# Altium schematic sheet Sheet1.SchDoc
size 431 x 279 mm; SheetNumber: 1; SheetTotal: 1; ENG_APP_DATE: --/--/--; DSN_APP_DATE: --/--/--; CHK_APP_DATE: --/--/--
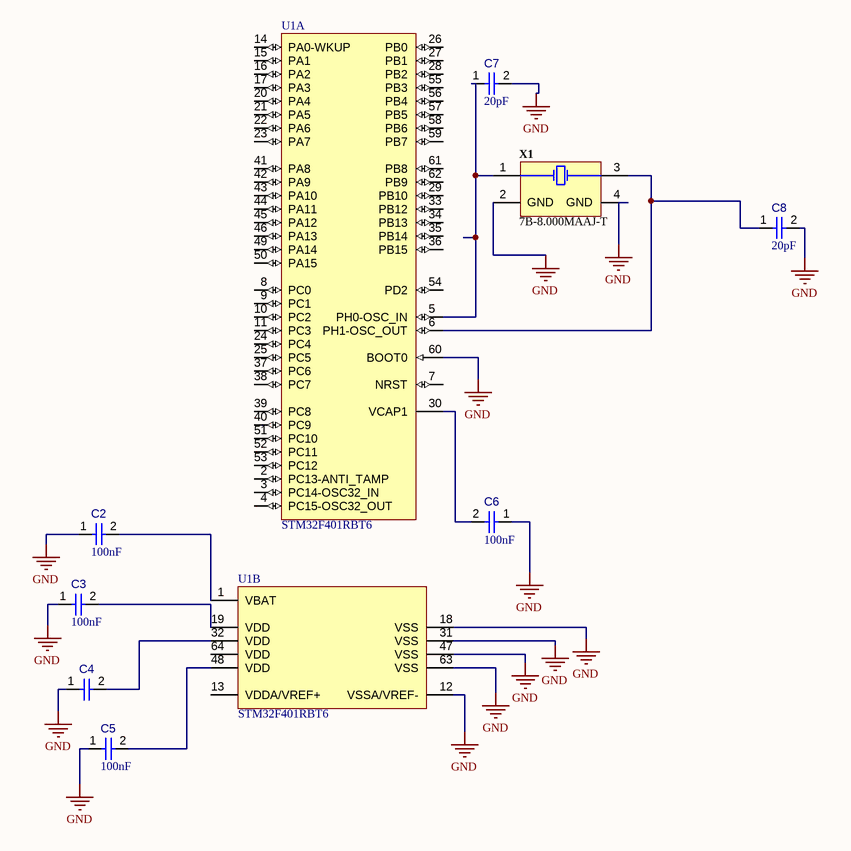
[diagram p0: Sheet1.SchDoc]

## Parts
C2  value 100nF  [CAPC0402(1005)60_L]  (hidden comment: Capacitor 100nF +/-20% 50V 0402)
C3  value 100nF  [CAPC0402(1005)60_L]  (hidden comment: Capacitor 100nF +/-20% 50V 0402)
C4  Capacitor 100nF +/-20% 50V 0402  [CAPC0402(1005)60_L]  (value not drawn)
C5  value 100nF  [CAPC0402(1005)60_L]  (hidden comment: Capacitor 100nF +/-20% 50V 0402)
C6  value 100nF  [CAPC0402(1005)60_L]  (hidden comment: Capacitor 100nF +/-20% 50V 0402)
C7  value 20pF  [CAPC0402(1005)60_L]  (hidden comment: Capacitor 100nF +/-20% 50V 0402)
C8  value 20pF  [CAPC0402(1005)60_L]  (hidden comment: Capacitor 100nF +/-20% 50V 0402)
U1  STM32F401RBT6  [STM-LQFP64_M]  (parts A,B of 2)
X1  7B-8.000MAAJ-T  [TXC-7B-4_V]

## Nets
GND: C2.1 C3.1 C4.1 C5.1 C6.1 C7.2 C8.2 U1.12(VSSA/VREF-) U1.18(VSS) U1.31(VSS) U1.47(VSS) U1.60(BOOT0) U1.63(VSS) X1.2(GND) X1.4(GND)
NetC2_2: C2.2 U1.1(VBAT)
NetC3_2: C3.2 U1.19(VDD)
NetC4_2: C4.2 U1.32(VDD)
NetC5_2: C5.2 U1.48(VDD)
NetC6_2: C6.2 U1.30(VCAP1)
NetC7_1: C7.1 U1.5(PH0-OSC_IN) X1.1(X1)
NetC8_1: C8.1 U1.6(PH1-OSC_OUT) X1.3(X2)

Not connected (* = marked no-connect by the designer): U1 2(PC13-ANTI_TAMP) 3(PC14-OSC32_IN) 4(PC15-OSC32_OUT) 7(NRST) 8(PC0) 9(PC1) 10(PC2) 11(PC3) 13(VDDA/VREF+) 14(PA0-WKUP) 15(PA1) 16(PA2) 17(PA3) 20(PA4) 21(PA5) 22(PA6) 23(PA7) 24(PC4) 25(PC5) 26(PB0) 27(PB1) 28(PB2) 29(PB10) 33(PB12) 34(PB13) 35(PB14) 36(PB15) 37(PC6) 38(PC7) 39(PC8) 40(PC9) 41(PA8) 42(PA9) 43(PA10) 44(PA11) 45(PA12) 46(PA13) 49(PA14) 50(PA15) 51(PC10) 52(PC11) 53(PC12) 54(PD2) 55(PB3) 56(PB4) 57(PB5) 58(PB6) 59(PB7) 61(PB8) 62(PB9) 64(VDD)

## Notes on the sheet
- DWG. NO.
- REV.
- SHT.
- THIS DOCUMENT AND THE DATA DISCLOSED HEREIN OR HEREWITH IS THE PROPERTY OF ALTIUM LIMITED AND MAY BE FREELY DISTRIBUTED IN WHOLE. NO RIGHTS ARE RESERVED OR EXPRESS OR IMPLIED WARANTEE GIVEN.
- REVISION
- DESCRIPTION
- DATE
- APPROVED
- ENG:
- APPROVALS
- PROJECT
- DSN:
- CHK:
- REFERENCE DOCUMENTS
- PROJECT REVISION:
- TITLE
- DOCUMENT REVISION:
- DESIGN ITEM:
- BOM:
- FAB DWG:
- PCB DWG:
- ASSY DWG:
- SCALE:
- SIZE
- B
- CAGE CODE
- FILE NAME
- DWG NO.
- SHEET
- OF
- REV

## Library data of the parts
C2-C8 = CMP-001-00067-3: Chip Capacitor, 100nF +/-20%, 50V, 0402, Thickness 0.6 mm; Tolerance: 10%; Min Operating Temperature: -55°C; Pins: 2; Case/Package: 0402; Max Operating Temperature: 85°C; Voltage Rating: 50V; Mounting Technology: SMT
U1 = CMP-020-00012-3: ARM Cortex -M4 32b MCU+FPU, 256 KB Flash, 64 KB RAM, -40 to 85 degC, 64-Pin LQFP, RoHS, Tray; Manufacturer: STMicroelectronics; Frequency: 84MHz; Interface: USART; Power: 313mW; Max Supply Voltage: 3.6V; RAM Size: 64KB; I/Os: 50; Density: 128KB; Min Supply Voltage: 1.8V; Datasheet URL: http://www.st.com/st-web-ui/static/active/en/resource/technical/document/datasheet/DM00086815.pdf; Package Quantity: 160; Package Description: 64-Pin Low-profile Quad Flat Package, Body 10 x 10 mm, Pitch 0.5 mm; Packaging: Tray; Case/Package: LQFP; Pins: 64; Mounting Technology: SM; RoHS Compliant: True; Datasheet Version: Rev. 5, 08/2015; Manufacturer URL: http://www.st.com/; Package Reference: LQFP64
X1 = CMP-003-00013-2: SMD Seam Sealing Crystal, 8 MHz, +/- 30 ppm, 18 pF, -10 to 70 degC, 4-Pin SMD, RoHS, Tape and Reel; Manufacturer: TXC; Frequency: 8MHz; Resistance: 100Ohm; Tolerance: 30ppm; Load Capacitance: 18pF; ESR: 100; Package Quantity: 1000; Datasheet URL: http://www.txccorp.com/download/products/quartz_crystals/2015TXC_7B_19.pdf; Case/Package: 7B-4; Packaging: TapeandReel; Frequency Tolerance: 30ppm; Min Operating Temperature: -20°C; RoHS Compliant: True; Package Reference: 7B-4; Mounting Technology: SM; Datasheet Version: Jul-15; Max Operating Temperature: 70°C; Package Description: 4-Pin Surface Mount Device, Body 5 x 3.2 mm, Pitch 3.7 mm; Pins: 4